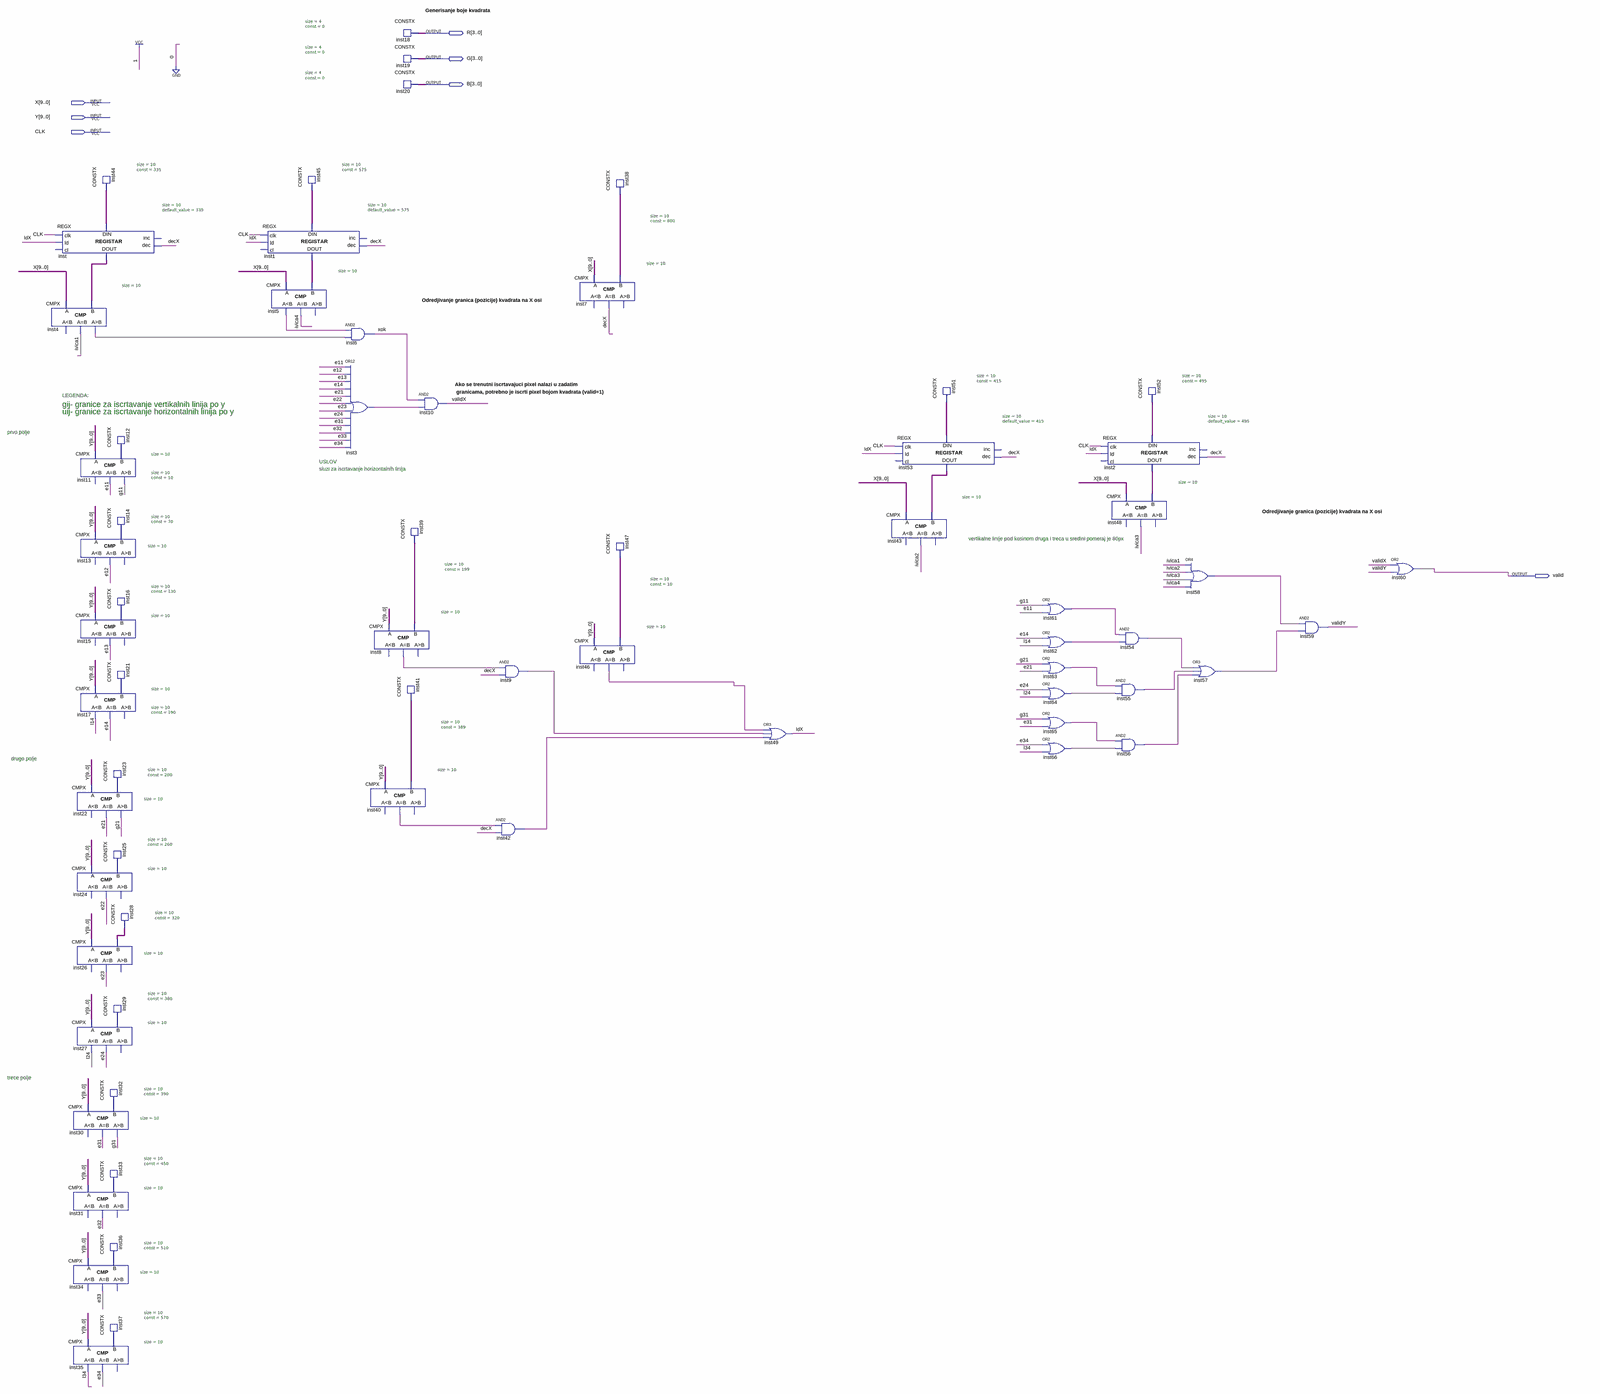
[diagram p0: schematic sheet, whole]
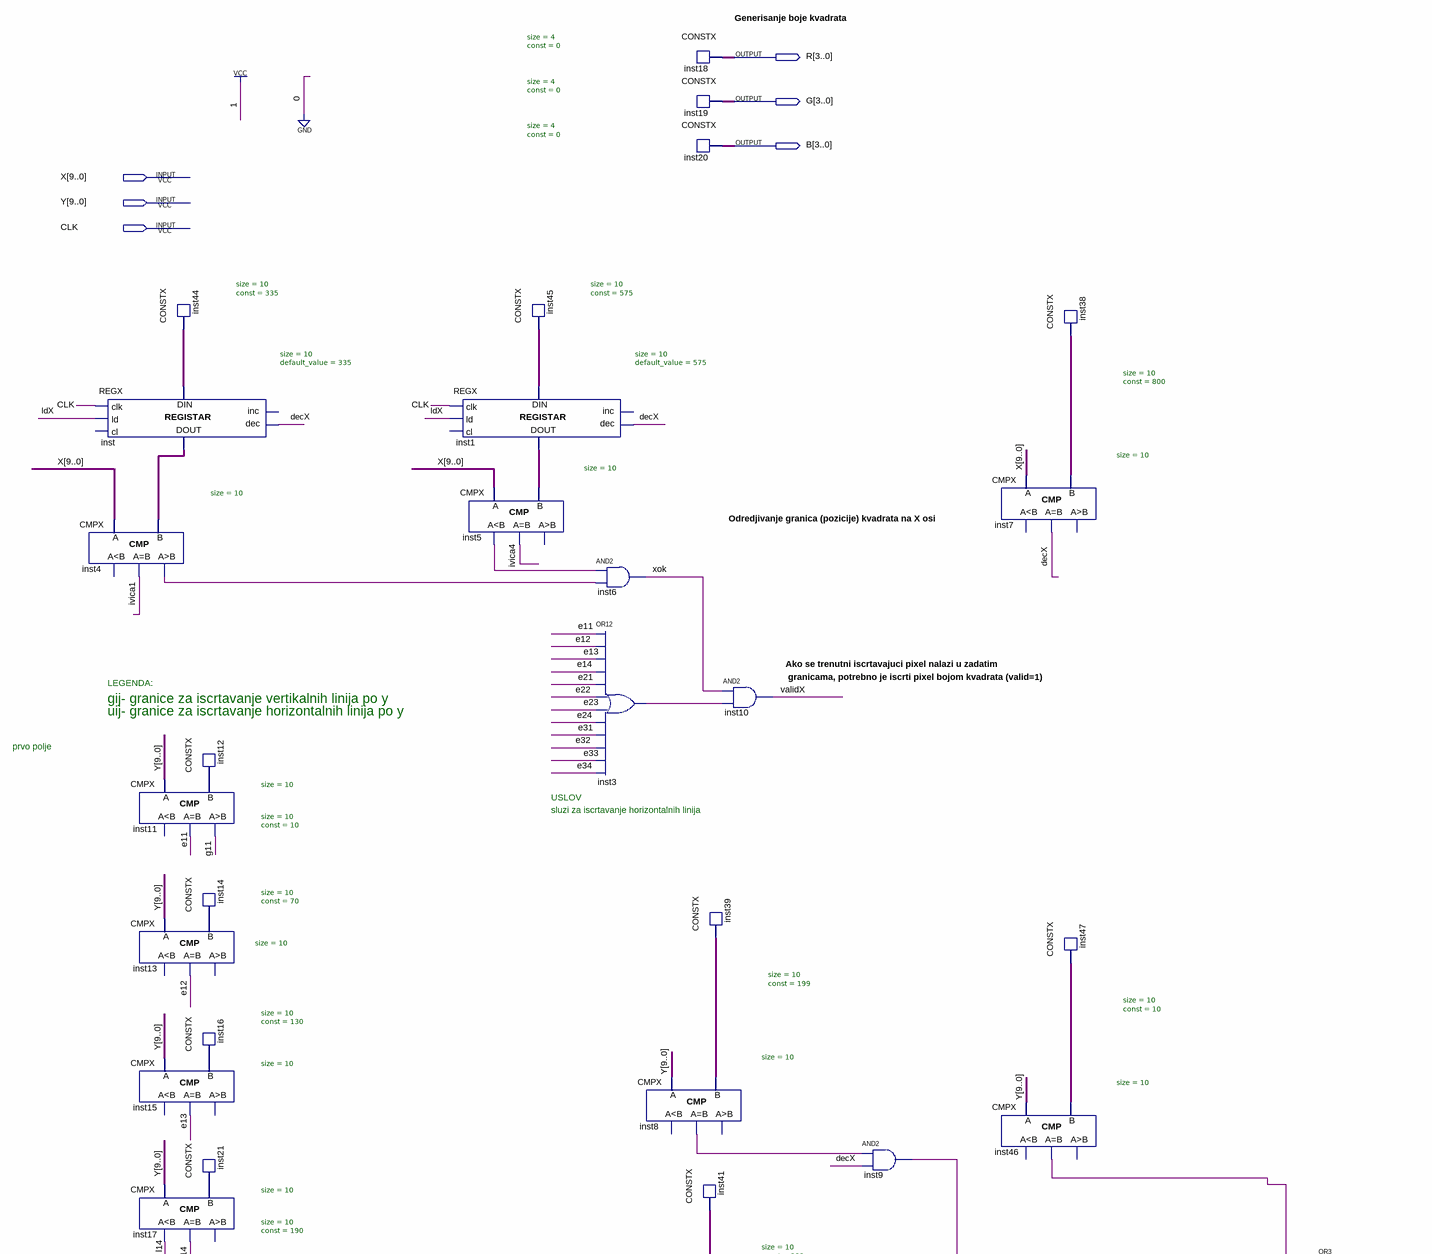
[diagram p1: schematic sheet, upper left part]
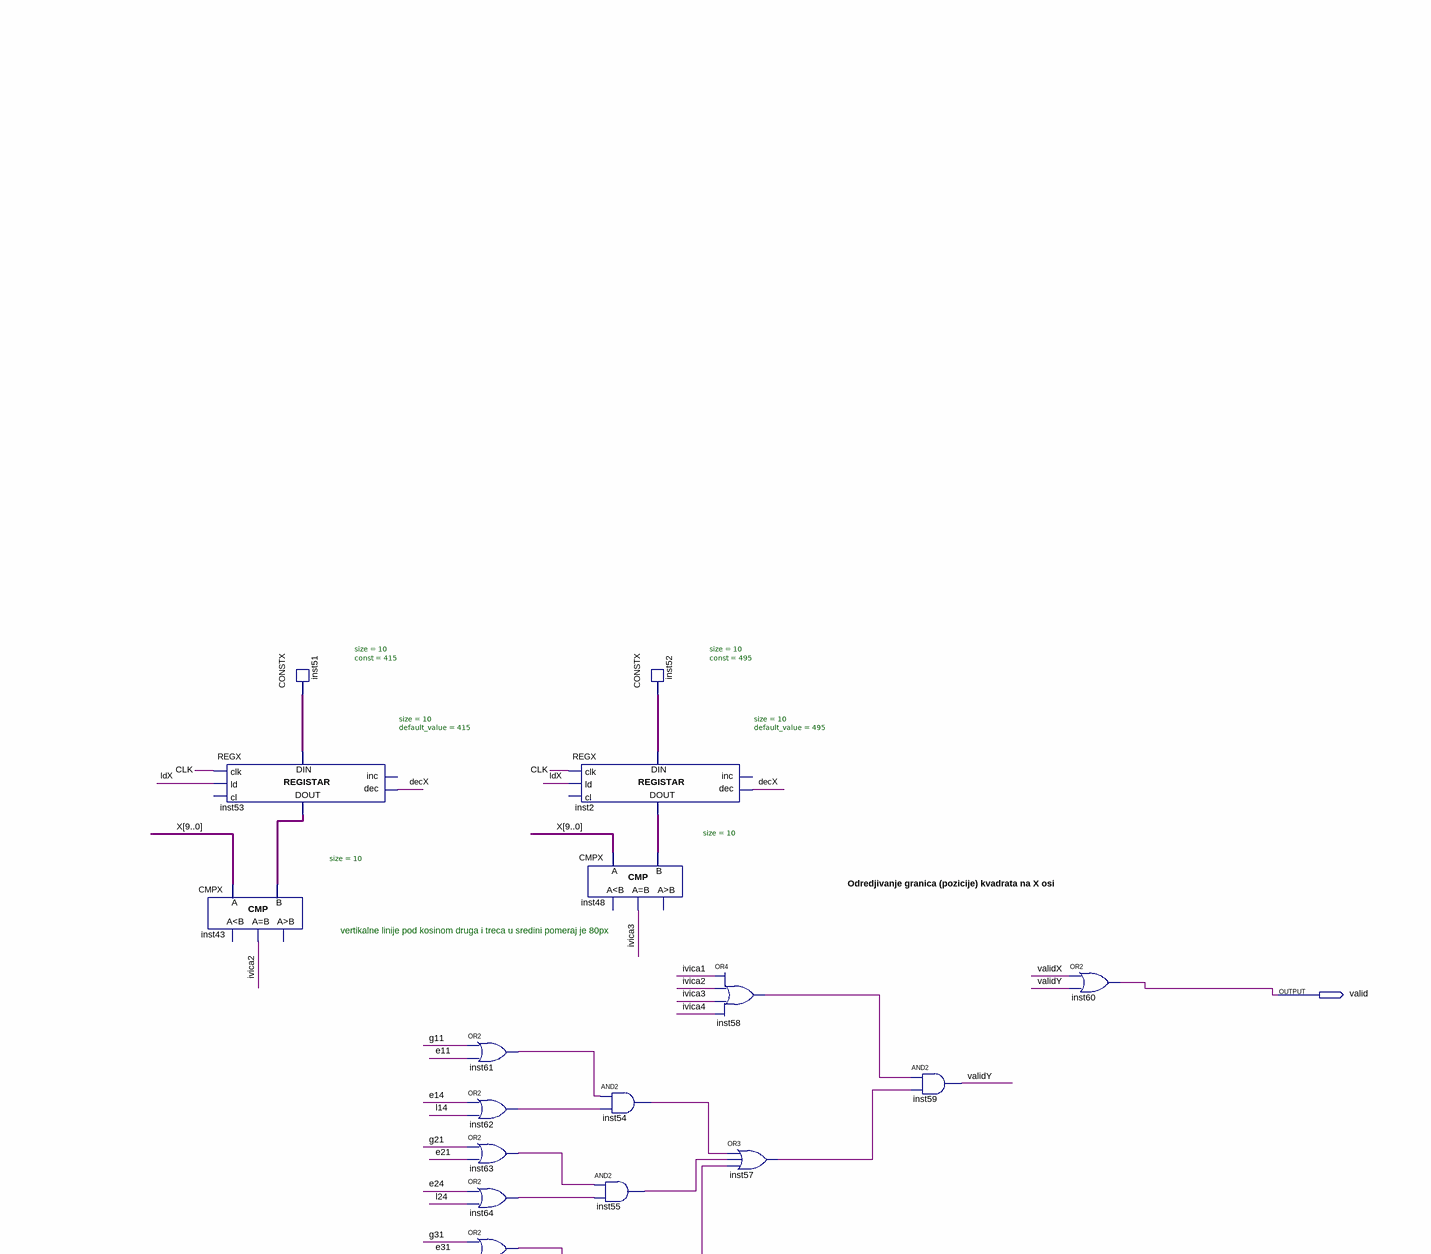
[diagram p2: schematic sheet, upper right part]
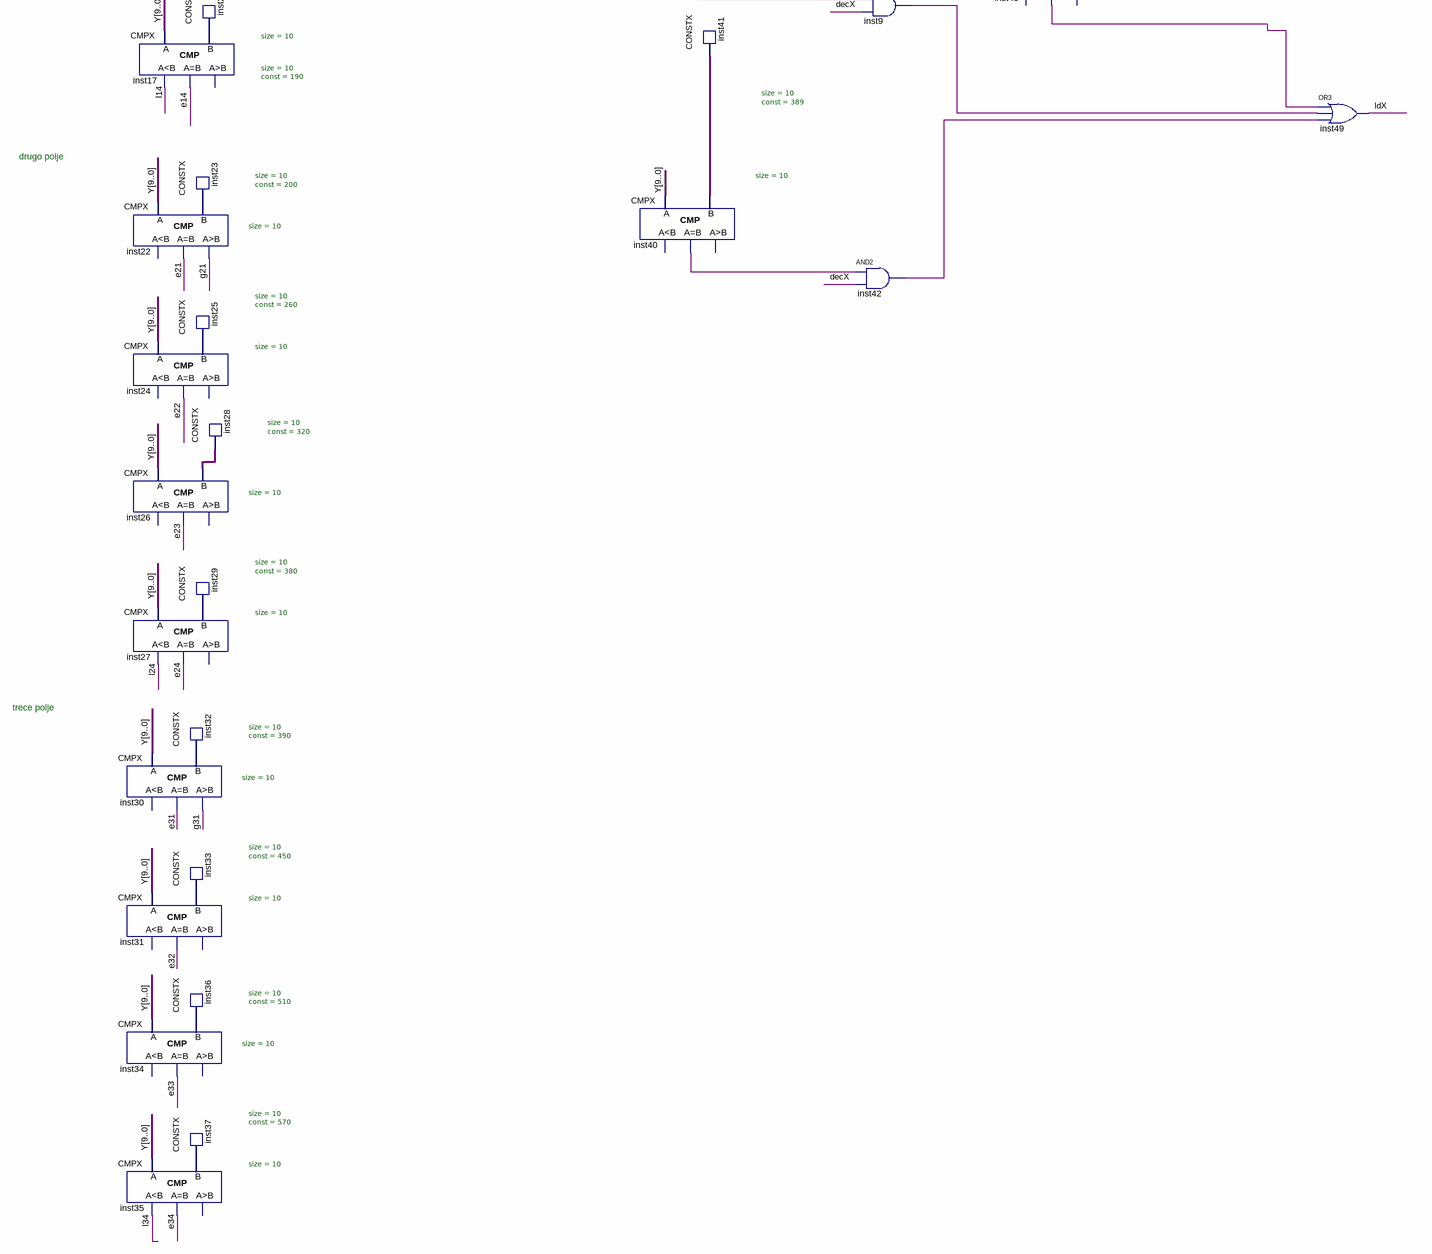
[diagram p3: schematic sheet, lower left part]
// Quartus schematic XOMreza.bdf as structural Verilog: 66 symbols, 7 pins
module XOMreza (
  input  [9:0] X,
  input  [9:0] Y,
  input  CLK,
  output [3:0] R,
  output [3:0] G,
  output [3:0] B,
  output valid
);

  wire decX, e11, e12, e13, e14, e21, e22, e23, e24, e31, e32, e33, e34, g11, g21, g31, inst3_out, inst4_gr,
       inst5_ls, inst8_eq, inst9_out, inst40_eq, inst42_out, inst46_eq, inst54_out, inst55_out, inst56_out,
       inst57_out, inst58_out, inst61_out, inst62_out, inst63_out, inst64_out, inst65_out, inst66_out,
       ivica1, ivica2, ivica3, ivica4, l14, l24, l34, ldX, validX, validY, xok;
  wire [9:0] inst1_data_out, inst2_data_out, inst12_data, inst14_data, inst16_data, inst21_data, inst23_data,
       inst25_data, inst28_data, inst29_data, inst32_data, inst33_data, inst36_data, inst37_data,
       inst38_data, inst39_data, inst41_data, inst44_data, inst45_data, inst47_data, inst51_data,
       inst52_data, inst53_data_out, inst_data_out;

  REGX #(.size(10), .default_value(335)) inst (
    .clk(CLK), .ld(ldX), .dec(decX), .data_in(inst44_data), .data_out(inst_data_out));  // open: cl, inc
  CMPX #(.size(10)) inst4 (.A(X), .B(inst_data_out), .eq(ivica1), .gr(inst4_gr));  // open: ls
  CMPX #(.size(10)) inst22 (.A(Y), .B(inst23_data), .eq(e21), .gr(g21));  // open: ls
  CMPX #(.size(10)) inst24 (.A(Y), .B(inst25_data), .eq(e22));  // open: ls, gr
  CMPX #(.size(10)) inst26 (.A(Y), .B(inst28_data), .eq(e23));  // open: ls, gr
  CMPX #(.size(10)) inst27 (.A(Y), .B(inst29_data), .ls(l24), .eq(e24));  // open: gr
  CMPX #(.size(10)) inst30 (.A(Y), .B(inst32_data), .eq(e31), .gr(g31));  // open: ls
  CMPX #(.size(10)) inst31 (.A(Y), .B(inst33_data), .eq(e32));  // open: ls, gr
  CMPX #(.size(10)) inst34 (.A(Y), .B(inst36_data), .eq(e33));  // open: ls, gr
  CMPX #(.size(10)) inst35 (.A(Y), .B(inst37_data), .ls(l34), .eq(e34));  // open: gr
  CONSTX #(.size(10), .\const (335)) inst44 (.data(inst44_data));
  CMPX #(.size(10)) inst11 (.A(Y), .B(inst12_data), .eq(e11), .gr(g11));  // open: ls
  CMPX #(.size(10)) inst13 (.A(Y), .B(inst14_data), .eq(e12));  // open: ls, gr
  CMPX #(.size(10)) inst15 (.A(Y), .B(inst16_data), .eq(e13));  // open: ls, gr
  CMPX #(.size(10)) inst17 (.A(Y), .B(inst21_data), .ls(l14), .eq(e14));  // open: gr
  CONSTX #(.size(10), .\const (390)) inst32 (.data(inst32_data));
  CONSTX #(.size(10), .\const (450)) inst33 (.data(inst33_data));
  CONSTX #(.size(10), .\const (510)) inst36 (.data(inst36_data));
  CONSTX #(.size(10), .\const (570)) inst37 (.data(inst37_data));
  CONSTX #(.size(10), .\const (10)) inst12 (.data(inst12_data));
  CONSTX #(.size(10), .\const (70)) inst14 (.data(inst14_data));
  CONSTX #(.size(10), .\const (130)) inst16 (.data(inst16_data));
  CONSTX #(.size(10), .\const (190)) inst21 (.data(inst21_data));
  CONSTX #(.size(10), .\const (200)) inst23 (.data(inst23_data));
  CONSTX #(.size(10), .\const (260)) inst25 (.data(inst25_data));
  CONSTX #(.size(10), .\const (320)) inst28 (.data(inst28_data));
  CONSTX #(.size(10), .\const (380)) inst29 (.data(inst29_data));
  REGX #(.size(10), .default_value(575)) inst1 (
    .clk(CLK), .ld(ldX), .dec(decX), .data_in(inst45_data), .data_out(inst1_data_out));  // open: cl, inc
  CMPX #(.size(10)) inst5 (.A(X), .B(inst1_data_out), .ls(inst5_ls), .eq(ivica4));  // open: gr
  CONSTX #(.size(10), .\const (575)) inst45 (.data(inst45_data));
  and inst6 (xok, inst5_ls, inst4_gr);
  or inst3 (inst3_out, e11, e12, e13, e14, e21, e22, e23, e24, e31, e32, e33, e34);
  CMPX #(.size(10)) inst40 (.A(Y), .B(inst41_data), .eq(inst40_eq));  // open: ls, gr
  CONSTX #(.size(4), .\const (0)) inst18 (.data(R));
  CONSTX #(.size(4), .\const (0)) inst19 (.data(G));
  CONSTX #(.size(4), .\const (0)) inst20 (.data(B));
  CMPX #(.size(10)) inst8 (.A(Y), .B(inst39_data), .eq(inst8_eq));  // open: ls, gr
  and inst10 (validX, xok, inst3_out);
  CONSTX #(.size(10), .\const (199)) inst39 (.data(inst39_data));
  CONSTX #(.size(10), .\const (389)) inst41 (.data(inst41_data));
  and inst9 (inst9_out, inst8_eq, decX);
  and inst42 (inst42_out, inst40_eq, decX);
  CMPX #(.size(10)) inst7 (.A(X), .B(inst38_data), .eq(decX));  // open: ls, gr
  CMPX #(.size(10)) inst46 (.A(Y), .B(inst47_data), .eq(inst46_eq));  // open: ls, gr
  CONSTX #(.size(10), .\const (800)) inst38 (.data(inst38_data));
  CONSTX #(.size(10), .\const (10)) inst47 (.data(inst47_data));
  or inst49 (ldX, inst46_eq, inst9_out, inst42_out);
  CMPX #(.size(10)) inst43 (.A(X), .B(inst53_data_out), .eq(ivica2));  // open: ls, gr
  REGX #(.size(10), .default_value(415)) inst53 (
    .clk(CLK), .ld(ldX), .dec(decX), .data_in(inst51_data), .data_out(inst53_data_out));  // open: cl, inc
  CONSTX #(.size(10), .\const (415)) inst51 (.data(inst51_data));
  or inst61 (inst61_out, g11, e11);
  or inst62 (inst62_out, e14, l14);
  or inst63 (inst63_out, g21, e21);
  or inst64 (inst64_out, e24, l24);
  or inst65 (inst65_out, g31, e31);
  or inst66 (inst66_out, e34, l34);
  REGX #(.size(10), .default_value(495)) inst2 (
    .clk(CLK), .ld(ldX), .dec(decX), .data_in(inst52_data), .data_out(inst2_data_out));  // open: cl, inc
  CMPX #(.size(10)) inst48 (.A(X), .B(inst2_data_out), .eq(ivica3));  // open: ls, gr
  and inst54 (inst54_out, inst61_out, inst62_out);
  and inst55 (inst55_out, inst63_out, inst64_out);
  and inst56 (inst56_out, inst65_out, inst66_out);
  CONSTX #(.size(10), .\const (495)) inst52 (.data(inst52_data));
  or inst58 (inst58_out, ivica1, ivica2, ivica3, ivica4);
  or inst57 (inst57_out, inst54_out, inst55_out, inst56_out);
  and inst59 (validY, inst58_out, inst57_out);
  or inst60 (valid, validX, validY);

  // Notes on the sheet:
  //   Generisanje boje kvadrata
  //   Odredjivanje granica (pozicije) kvadrata na X osi
  //   Ako se trenutni iscrtavajuci pixel nalazi u zadatim
  //    granicama, potrebno je iscrti pixel bojom kvadrata (valid=1)
  //   LEGENDA:
  //   gij- granice za iscrtavanje vertikalnih linija po y
  //   uij- granice za iscrtavanje horizontalnih linija po y
  //   prvo polje
  //   USLOV
  //   sluzi za iscrtavanje horizontalnih linija
  //   Odredjivanje granica (pozicije) kvadrata na X osi
  //   vertikalne linije pod kosinom druga i treca u sredini pomeraj je 80px
  //   drugo polje
  //   trece polje
endmodule
